# Altium schematic sheet driver.SchDoc: driver
size 582 x 469 mm; Origin: Eagle; Date: 4/18/2023 7:39:10 AM; SheetNumber: 1; GateName_1: G$1; SymbolName_1: FRAME_C_L; LibraryName: frames; DeviceSetName: FRAME_C_L; GateName_2: G$2; SymbolName_2: DOCFIELD; Sheet: Sheet:; REV: REV:
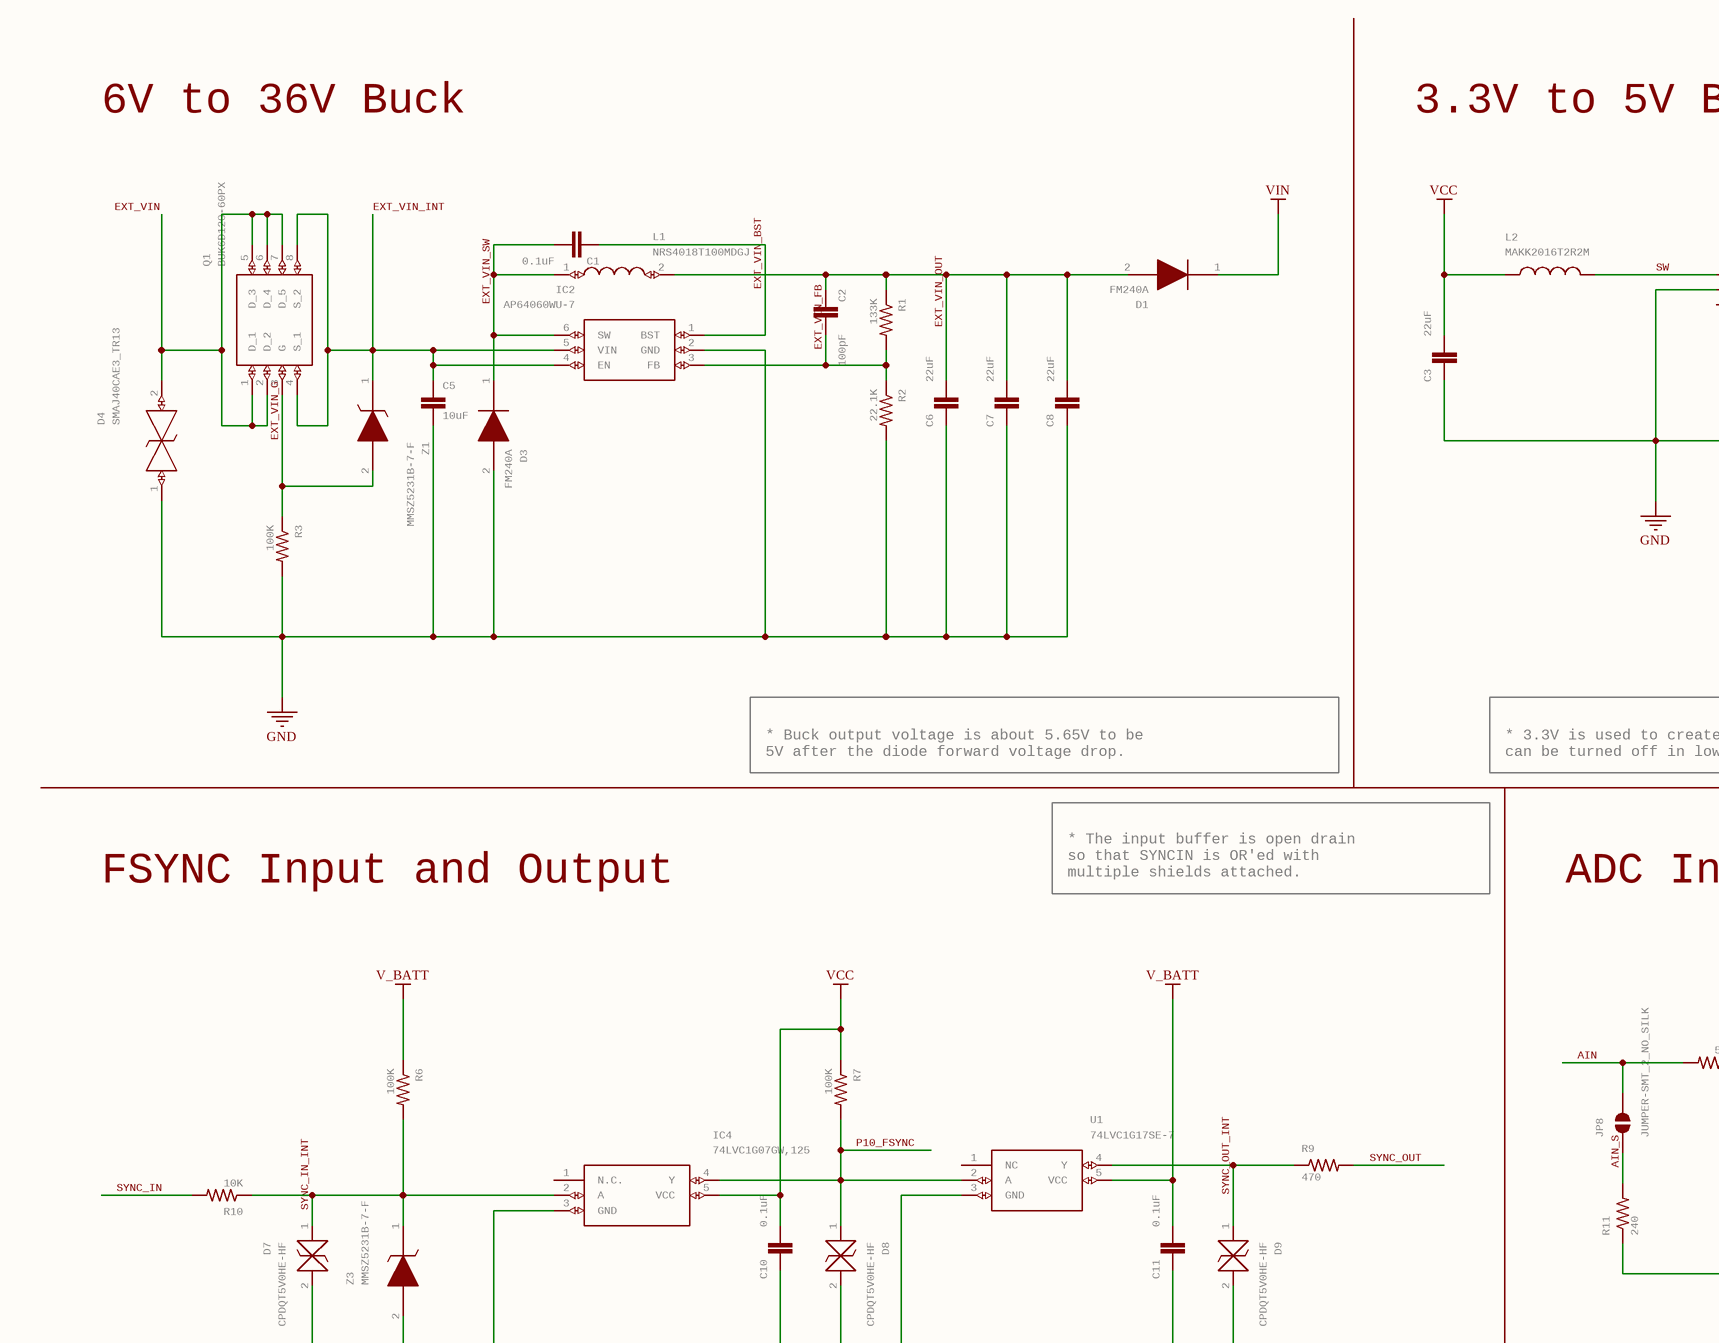
[diagram p0: driver.SchDoc, top left]
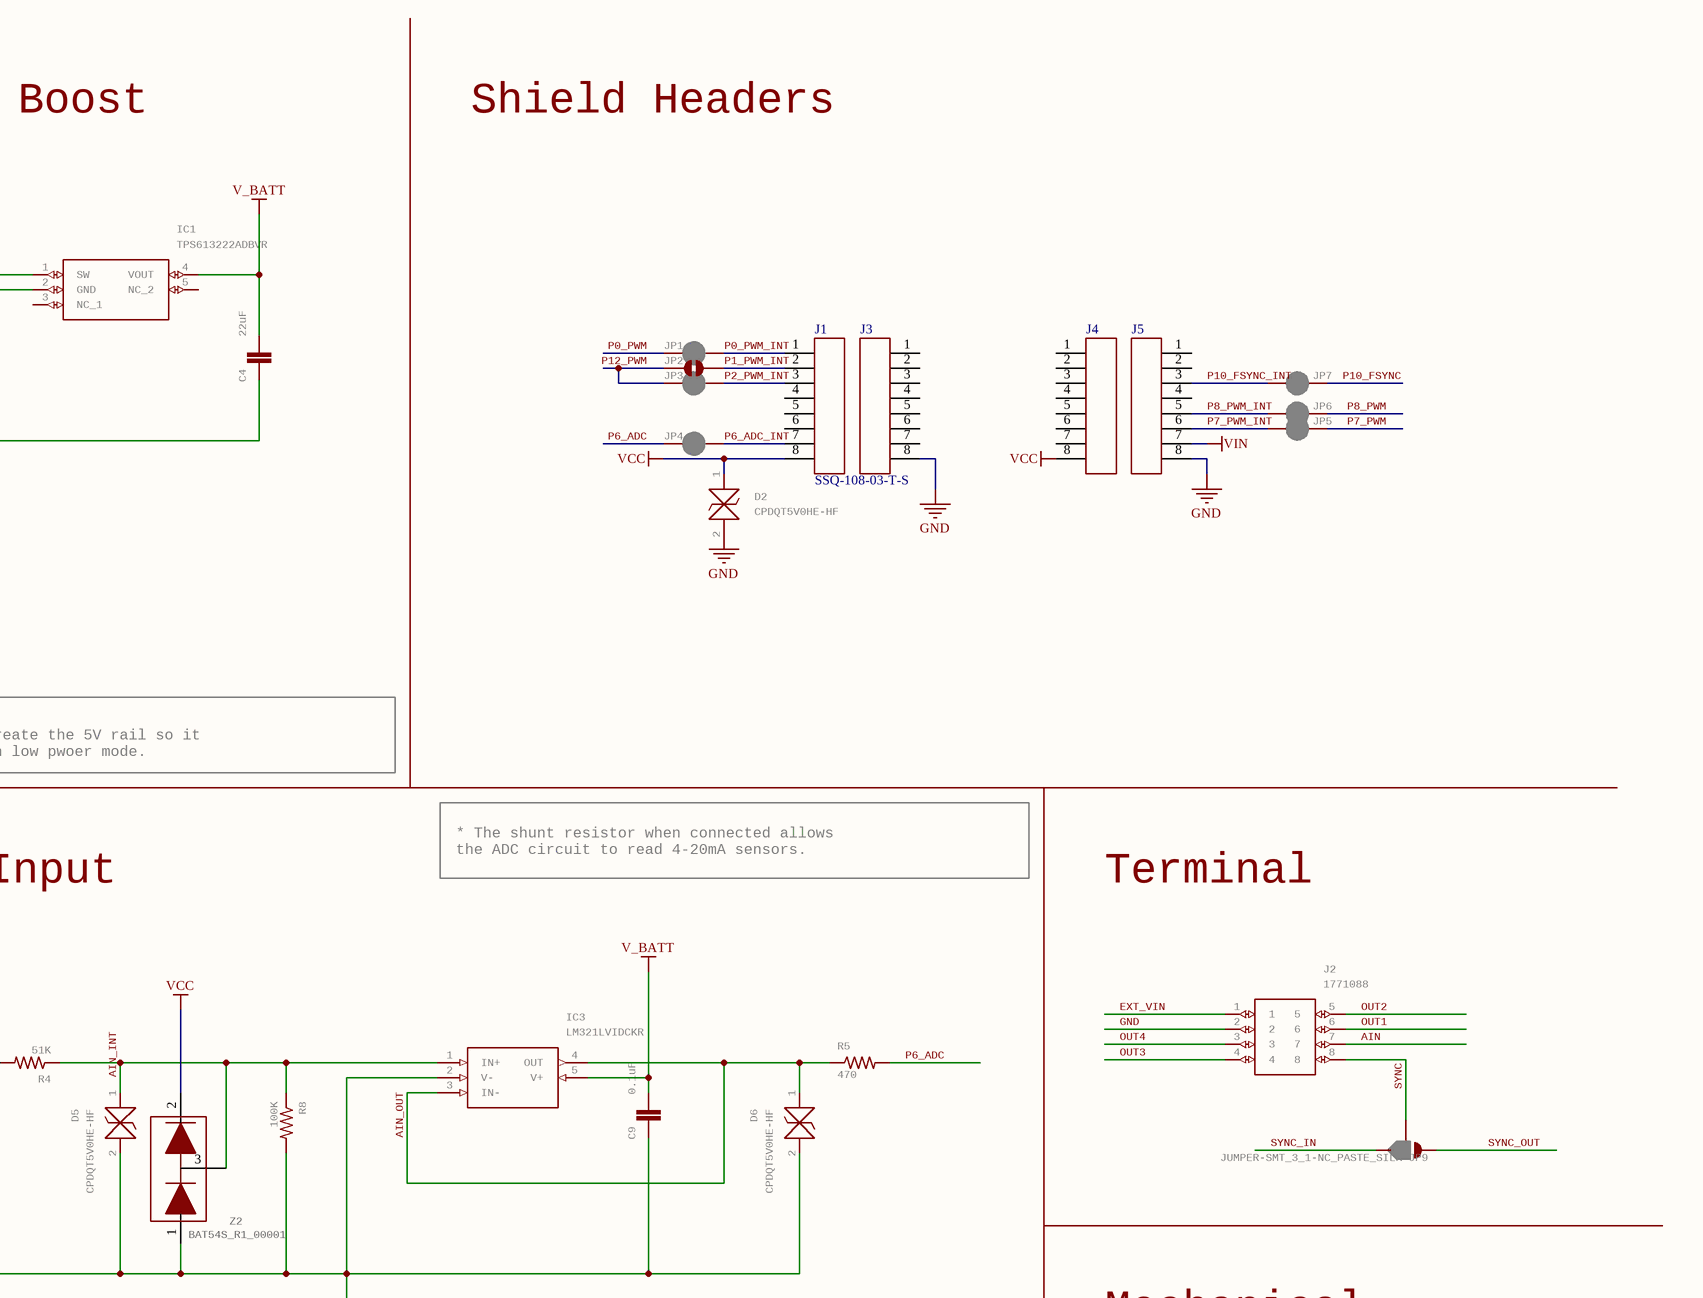
[diagram p1: driver.SchDoc, top right]
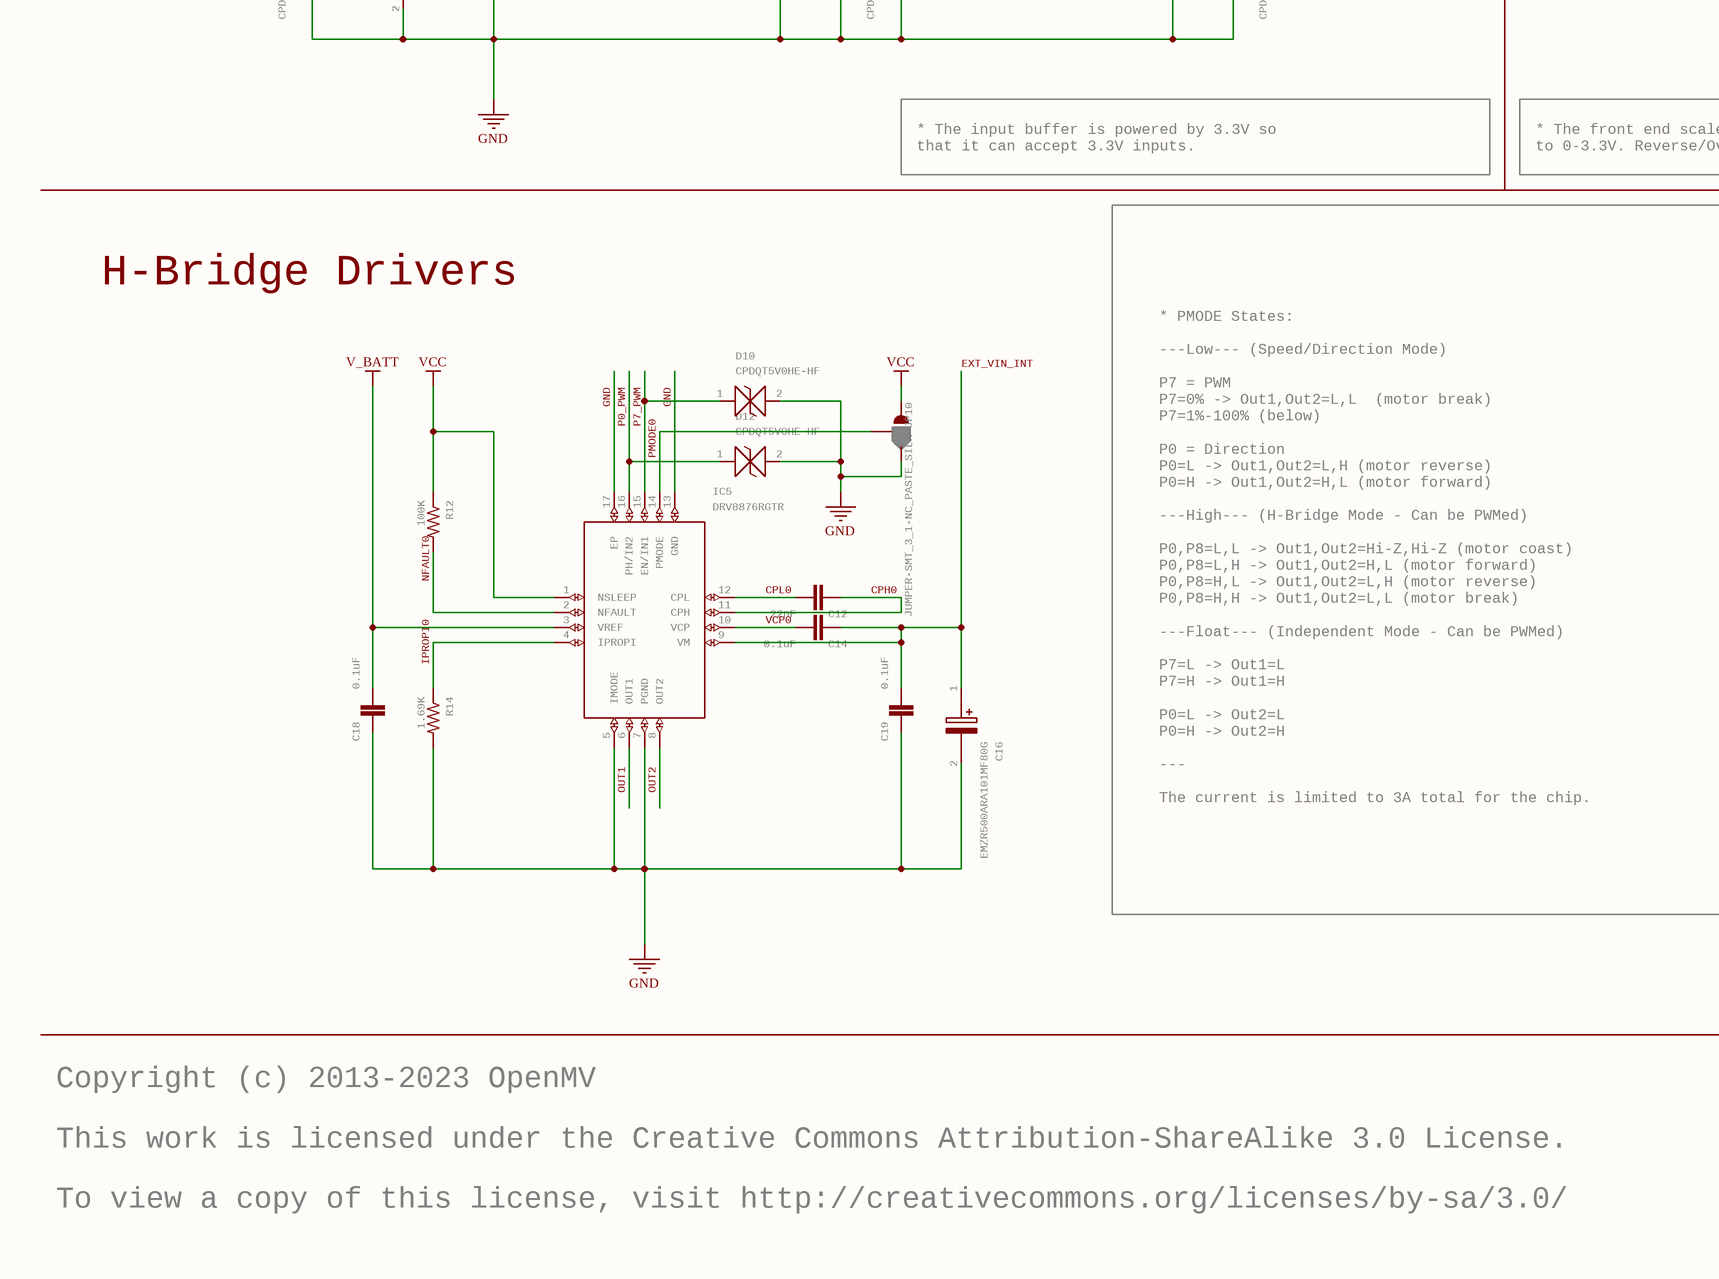
[diagram p2: driver.SchDoc, bottom left]
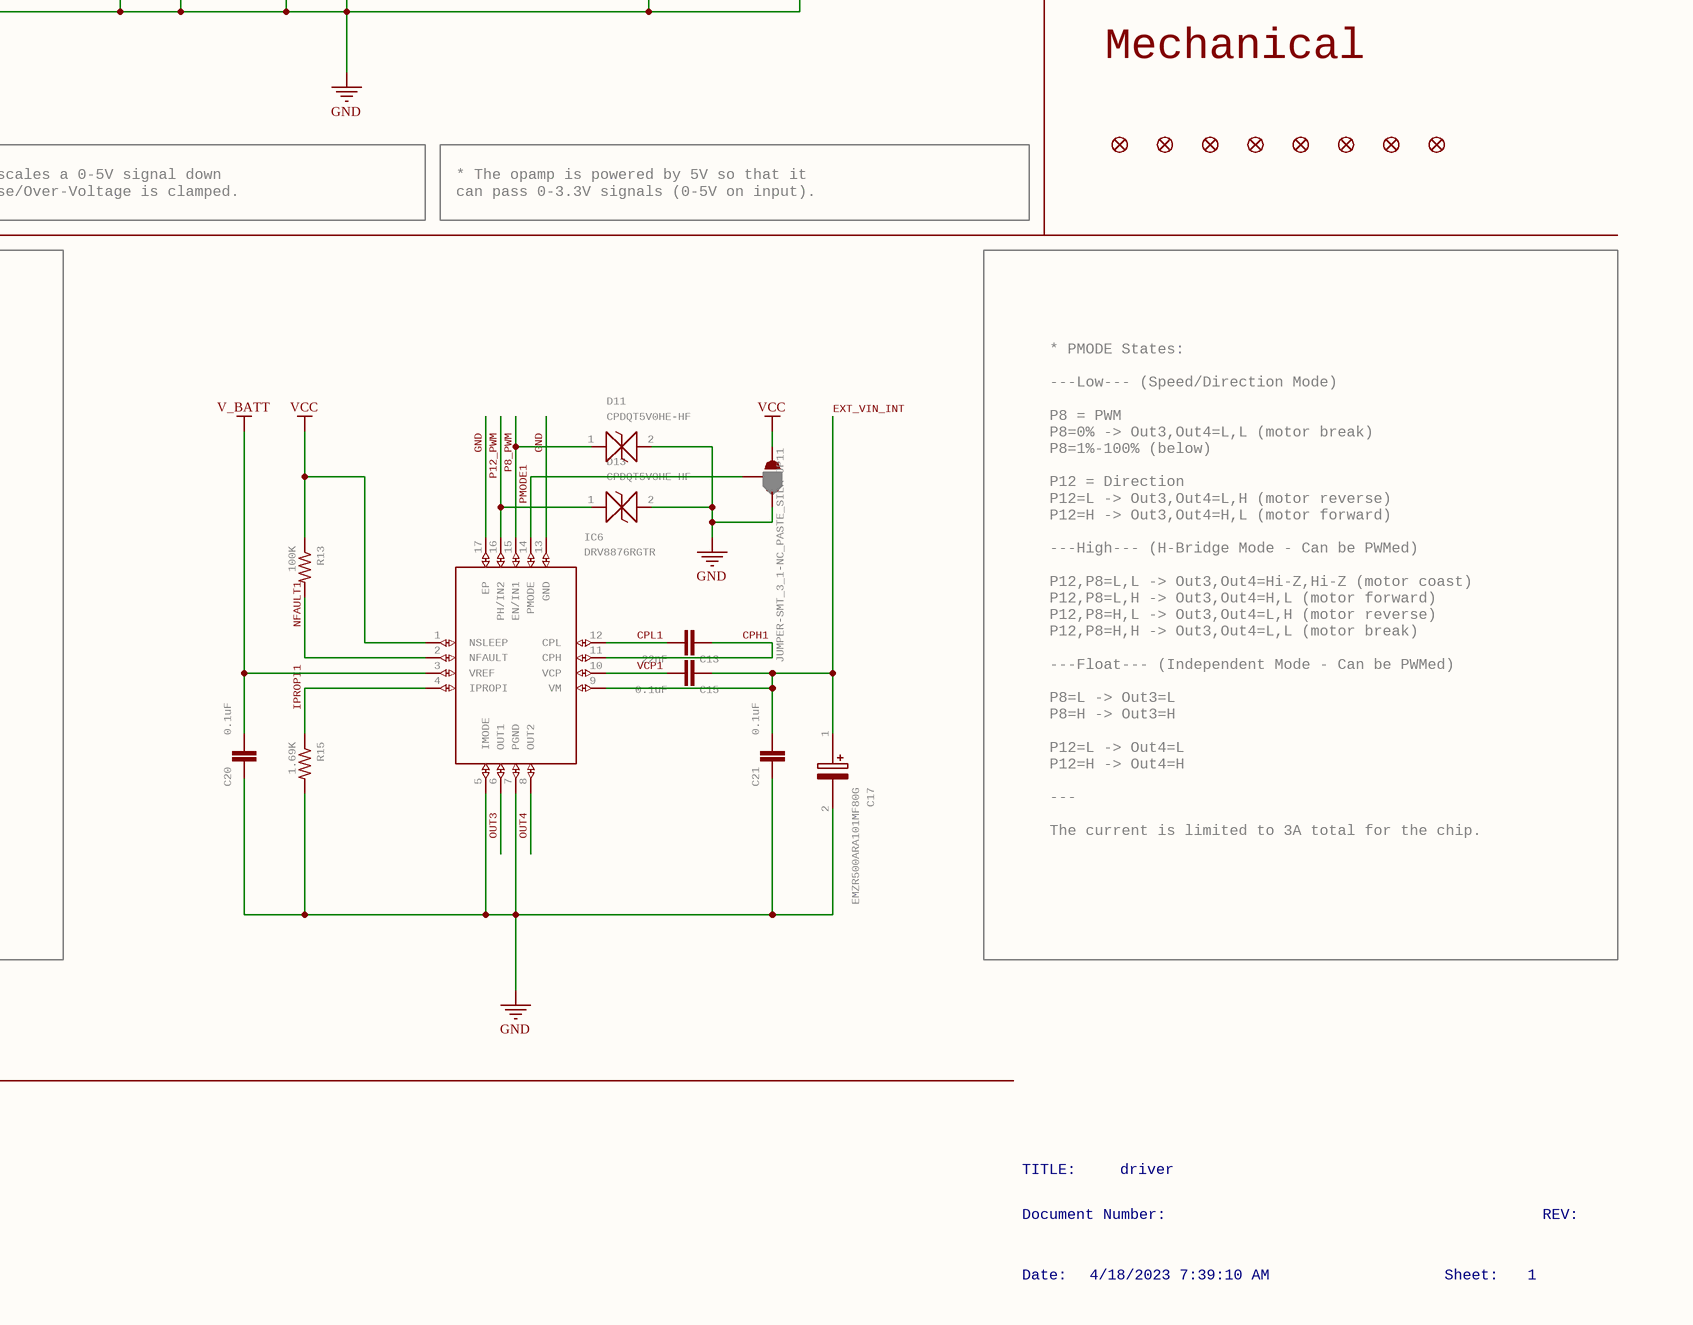
[diagram p3: driver.SchDoc, bottom right]

## Parts
C1  0.1uF  [0402-CAP]
C2  100pF  [0402-CAP]
C3  22uF  [0805]
C4  22uF  [0805]
C5  10uF  [C0805]
C6  22uF  [0805]
C7  22uF  [0805]
C8  22uF  [0805]
C9  0.1uF  [0402-CAP]
C10  0.1uF  [0402-CAP]
C11  0.1uF  [0402-CAP]
C12  22nF  [0402-CAP]
C13  22nF  [0402-CAP]
C14  0.1uF  [0402-CAP]
C15  0.1uF  [0402-CAP]
C16  EMZR500ARA101MF80G  [CAPAE660X820N]
C17  EMZR500ARA101MF80G  [CAPAE660X820N]
C18  0.1uF  [0402-CAP]
C19  0.1uF  [0402-CAP]
C20  0.1uF  [0402-CAP]
C21  0.1uF  [0402-CAP]
D1  FM240A  [DIOM5025X231N]
D2  CPDQT5V0HE-HF  [CPDQT5V0HEHF]
D3  FM240A  [DIOM5025X231N]
D4  SMAJ40CAE3_TR13  [SMAJ40CAE3TR13]
D5  CPDQT5V0HE-HF  [CPDQT5V0HEHF]
D6  CPDQT5V0HE-HF  [CPDQT5V0HEHF]
D7  CPDQT5V0HE-HF  [CPDQT5V0HEHF]
D8  CPDQT5V0HE-HF  [CPDQT5V0HEHF]
D9  CPDQT5V0HE-HF  [CPDQT5V0HEHF]
D10  CPDQT5V0HE-HF  [CPDQT5V0HEHF]
D11  CPDQT5V0HE-HF  [CPDQT5V0HEHF]
D12  CPDQT5V0HE-HF  [CPDQT5V0HEHF]
D13  CPDQT5V0HE-HF  [CPDQT5V0HEHF]
FD1  FIDUCIAL1X2  [FIDUCIAL-1X2]  (value not drawn)
FD2  FIDUCIAL1X2  [FIDUCIAL-1X2]  (value not drawn)
FD3  FIDUCIAL1X2  [FIDUCIAL-1X2]  (value not drawn)
FD4  FIDUCIAL1X2  [FIDUCIAL-1X2]  (value not drawn)
FD5  FIDUCIAL1X2  [FIDUCIAL-1X2]  (value not drawn)
FD6  FIDUCIAL1X2  [FIDUCIAL-1X2]  (value not drawn)
FD7  FIDUCIAL1X2  [FIDUCIAL-1X2]  (value not drawn)
FD8  FIDUCIAL1X2  [FIDUCIAL-1X2]  (value not drawn)
IC1  TPS613222ADBVR  [SOT95P280X145-5N]
IC2  AP64060WU-7  [SOT95P280X100-6N]
IC3  LM321LVIDCKR  [SOT65P210X110-5N]
IC4  74LVC1G07GW,125  [SOT65P212X110-5N]
IC5  DRV8876RGTR  [QFN50P300X300X100-17N]
IC6  DRV8876RGTR  [QFN50P300X300X100-17N]
J1  SSQ-108-03-T-S  [HDR_1X8]
J2  1771088  [1771088]
J3  SSQ-108-03-T-S  [HDR_1X8]  (value not drawn)
J4  SSQ-108-03-T-S  [HDR_1X8]  (value not drawn)
J5  SSQ-108-03-T-S  [HDR_1X8]  (value not drawn)
JP1  JUMPER-SMT_2_NC_PASTE_SILK  [SMT-JUMPER_2_NC_PASTE_SILK]  (value not drawn)
JP2  JUMPER-SMT_2_NO_SILK  [SMT-JUMPER_2_NO_SILK]  (value not drawn)
JP3  JUMPER-SMT_2_NC_PASTE_SILK  [SMT-JUMPER_2_NC_PASTE_SILK]  (value not drawn)
JP4  JUMPER-SMT_2_NC_PASTE_SILK  [SMT-JUMPER_2_NC_PASTE_SILK]  (value not drawn)
JP5  JUMPER-SMT_2_NC_PASTE_SILK  [SMT-JUMPER_2_NC_PASTE_SILK]  (value not drawn)
JP6  JUMPER-SMT_2_NC_PASTE_SILK  [SMT-JUMPER_2_NC_PASTE_SILK]  (value not drawn)
JP7  JUMPER-SMT_2_NC_PASTE_SILK  [SMT-JUMPER_2_NC_PASTE_SILK]  (value not drawn)
JP8  JUMPER-SMT_2_NO_SILK  [SMT-JUMPER_2_NO_SILK]
JP9  JUMPER-SMT_3_1-NC_PASTE_SILK  [SMT-JUMPER_3_1-NC_PASTE_SILK]
JP10  JUMPER-SMT_3_1-NC_PASTE_SILK  [SMT-JUMPER_3_1-NC_PASTE_SILK]
JP11  JUMPER-SMT_3_1-NC_PASTE_SILK  [SMT-JUMPER_3_1-NC_PASTE_SILK]
L1  NRS4018T100MDGJ  [NRS4018T100MDGJ]
L2  MAKK2016T2R2M  [INDC2016X100N]
Q1  BUK6D120-60PX  [BUK6D12060PX]
R1  133K  [0402-RES]
R2  22.1K  [0402-RES]
R3  100K  [0402-RES]
R4  51K  [0402-RES]
R5  470  [R0603]
R6  100K  [0402-RES]
R7  100K  [0402-RES]
R8  100K  [0402-RES]
R9  470  [R0603]
R10  10K  [0402-RES]
R11  240  [R0603]
R12  100K  [0402-RES]
R13  100K  [0402-RES]
R14  1.69K  [0402-RES]
R15  1.69K  [0402-RES]
U1  74LVC1G17SE-7  [SOT65P210X110-5N]
Z1  MMSZ5231B-7-F  [SOD3716X145N]
Z2  BAT54S_R1_00001  [SOT23-3]
Z3  MMSZ5231B-7-F  [SOD3716X145N]

## Nets
GND: C3.1 C4.1 C5.2 C6.1 C7.1 C8.1 C9.1 C10.1 C11.1 C16.2(-) C17.2(-) C18.1 C19.1 C20.1 C21.1 D2.2 D3.2(A) D4.1 D5.2 D6.2 D7.2 D8.2 D9.2 D10.2 D11.2 D12.2 D13.2 IC1.2(GND) IC2.2(GND) IC3.2(V-) IC4.3(GND) IC5.5(IMODE) IC5.7(PGND) IC5.13(GND) IC5.17(EP) IC6.5(IMODE) IC6.7(PGND) IC6.13(GND) IC6.17(EP) J2.2 J3.8 J5.8 JP10.3 JP11.3 R2.2 R3.2 R8.2 R11.1 R14.2 R15.2 U1.3(GND) Z2.1 Z3.2(A)
V_BATT: C4.2 C9.2 C11.2 C18.2 C20.2 IC1.4(VOUT) IC3.5(V+) IC5.3(VREF) IC6.3(VREF) R6.1 U1.5(VCC)
VCC: C3.2 C10.2 D2.1 IC4.5(VCC) IC5.1(NSLEEP) IC6.1(NSLEEP) J1.8 J4.8 JP10.1 JP11.1 L2.1 R7.1 R12.1 R13.1 Z2.2
VIN: D1.1(K) J5.7
AIN: J2.7 JP8.2 R4.2
AIN_INT: D5.1 IC3.1(IN+) R4.1 R8.1 Z2.3
AIN_OUT: D6.1 IC3.3(IN-) IC3.4(OUT) R5.1
AIN_S: JP8.1 R11.2
CPH0: C12.1 IC5.11(CPH)
CPH1: C13.1 IC6.11(CPH)
CPL0: C12.2 IC5.12(CPL)
CPL1: C13.2 IC6.12(CPL)
EXT_VIN: D4.2 J2.1 Q1.1(D_1) Q1.2(D_2) Q1.5(D_3) Q1.6(D_4) Q1.7(D_5)
EXT_VIN_BST: C1.1 IC2.1(BST)
EXT_VIN_FB: C2.2 IC2.3(FB) R1.2 R2.1
EXT_VIN_G: Q1.3(G) R3.1 Z1.2(A)
EXT_VIN_INT: C5.1 C14.1 C15.1 C16.1(+) C17.1(+) C19.2 C21.2 IC2.4(EN) IC2.5(VIN) IC5.9(VM) IC6.9(VM) Q1.4(S_1) Q1.8(S_2) Z1.1(K)
EXT_VIN_OUT: C2.1 C6.2 C7.2 C8.2 D1.2(A) L1.2 R1.1
EXT_VIN_SW: C1.2 D3.1(K) IC2.6(SW) L1.1
IPROPI0: IC5.4(IPROPI) R14.1
IPROPI1: IC6.4(IPROPI) R15.1
NFAULT0: IC5.2(NFAULT) R12.2
NFAULT1: IC6.2(NFAULT) R13.2
OUT1: IC5.6(OUT1) J2.6
OUT2: IC5.8(OUT2) J2.5
OUT3: IC6.6(OUT1) J2.4
OUT4: IC6.8(OUT2) J2.3
P0_PWM: D12.1 IC5.16(PH/IN2) JP1.2
P0_PWM_INT: J1.1 JP1.1
P1_PWM_INT: J1.2 JP2.1
P2_PWM_INT: J1.3 JP3.1
P6_ADC: JP4.2 R5.2
P6_ADC_INT: J1.7 JP4.1
P7_PWM: D10.1 IC5.15(EN/IN1) JP5.2
P7_PWM_INT: J5.6 JP5.1
P8_PWM: D11.1 IC6.15(EN/IN1) JP6.2
P8_PWM_INT: J5.5 JP6.1
P10_FSYNC: D8.1 IC4.4(Y) JP7.2 R7.2 U1.2(A)
P10_FSYNC_INT: J5.3 JP7.1
P12_PWM: D13.1 IC6.16(PH/IN2) JP2.2 JP3.2
PMODE0: IC5.14(PMODE) JP10.2
PMODE1: IC6.14(PMODE) JP11.2
SW: IC1.1(SW) L2.2
SYNC: J2.8 JP9.2
SYNC_IN: JP9.3 R10.2
SYNC_IN_INT: D7.1 IC4.2(A) R6.2 R10.1 Z3.1(K)
SYNC_OUT: JP9.1 R9.2
SYNC_OUT_INT: D9.1 R9.1 U1.4(Y)
VCP0: C14.2 IC5.10(VCP)
VCP1: C15.2 IC6.10(VCP)

Not connected (* = marked no-connect by the designer): IC1 3(NC_1) 5(NC_2); IC4 1(N.C.); J1 4 5 6; J3 1 2 3 4 5 6 7; J4 1 2 3 4 5 6 7; J5 1 2 4; U1 1(NC)

## Notes on the sheet
- 6V to 36V Buck
- 3.3V to 5V Boost
- Shield Headers
- * Buck output voltage is about 5.65V to be
  5V after the diode forward voltage drop.
- * 3.3V is used to create the 5V rail so it
  can be turned off in low pwoer mode.
- * The shunt resistor when connected allows
  the ADC circuit to read 4-20mA sensors.
- FSYNC Input and Output
- * The input buffer is open drain
  so that SYNCIN is OR'ed with
  multiple shields attached.
- ADC Input
- Terminal
- Mechanical
- * The input buffer is powered by 3.3V so
  that it can accept 3.3V inputs.
- * The front end scales a 0-5V signal down
  to 0-3.3V. Reverse/Over-Voltage is clamped.
- * The opamp is powered by 5V so that it
  can pass 0-3.3V signals (0-5V on input).
- H-Bridge Drivers
- * PMODE States:
  ---Low--- (Speed/Direction Mode)
  P7 = PWM
  P7=0% -> Out1,Out2=L,L  (motor break)
  P7=1%-100% (below)
  P0 = Direction
  P0=L -> Out1,Out2=L,H (motor reverse)
  P0=H -> Out1,Out2=H,L (motor forward)
  ---High--- (H-Bridge Mode - Can be PWMed)
  P0,P8=L,L -> Out1,Out2=Hi-Z,Hi-Z (motor coast)
  P0,P8=L,H -> Out1,Out2=H,L (motor forward)
  P0,P8=H,L -> Out1,Out2=L,H (motor reverse)
  P0,P8=H,H -> Out1,Out2=L,L (motor break)
  ---Float--- (Independent Mode - Can be PWMed)
  P7=L -> Out1=L
  P7=H -> Out1=H
  P0=L -> Out2=L
  P0=H -> Out2=H
  ---
  The current is limited to 3A total for the chip.
- * PMODE States:
  ---Low--- (Speed/Direction Mode)
  P8 = PWM
  P8=0% -> Out3,Out4=L,L (motor break)
  P8=1%-100% (below)
  P12 = Direction
  P12=L -> Out3,Out4=L,H (motor reverse)
  P12=H -> Out3,Out4=H,L (motor forward)
  ---High--- (H-Bridge Mode - Can be PWMed)
  P12,P8=L,L -> Out3,Out4=Hi-Z,Hi-Z (motor coast)
  P12,P8=L,H -> Out3,Out4=H,L (motor forward)
  P12,P8=H,L -> Out3,Out4=L,H (motor reverse)
  P12,P8=H,H -> Out3,Out4=L,L (motor break)
  ---Float--- (Independent Mode - Can be PWMed)
  P8=L -> Out3=L
  P8=H -> Out3=H
  P12=L -> Out4=L
  P12=H -> Out4=H
  ---
  The current is limited to 3A total for the chip.
- Copyright (c) 2013-2023 OpenMV
- TITLE:
- driver
- This work is licensed under the Creative Commons Attribution-ShareAlike 3.0 License.
- To view a copy of this license, visit http://creativecommons.org/licenses/by-sa/3.0/
- Document Number:
- REV:
- Date:
- 4/18/2023 7:39:10 AM
- Sheet:
- 1

## Library data of the parts
C1 C9-C11 C14 C15 C18-C21 = CAP0402-CAP: CapacitorStandard 0603 ceramic capacitor, and 0.1" leaded capacitor.; MPN: GRM155R71H104KE14D; GateName_1: G$1; SymbolName_1: CAP; DeviceName: 0402-CAP; LibraryName: sfe; DeviceSetName: CAP
C2 = CAP0402-CAP: CapacitorStandard 0603 ceramic capacitor, and 0.1" leaded capacitor.; MPN: CC0402JRNPO9BN101; GateName_1: G$1; SymbolName_1: CAP; DeviceName: 0402-CAP; LibraryName: sfe; DeviceSetName: CAP
C3 C4 C6-C8 = 22UF-0805-6.3V-20%: 22ÂµF ceramic capacitors    A capacitor is a passive two-terminal electrical component used to store electrical energy temporarily in an electric field.; MPN: CL21A226MQQNNNE; GateName_1: G$1; SymbolName_1: CAP; PROD_ID: CAP-08402; DeviceName: -0805-6.3V-20%; LibraryName: SparkFun-Capacitors; DeviceSetName: 22UF
C5 = C-EUC0805: CAPACITOR, European symbol; MPN: GRM21BR61H106KE43K; GateName_1: G$1; SymbolName_1: C-EU; POPULARITY: 88; DeviceName: C0805; LibraryName: rcl; DeviceSetName: C-EU; SPICEPREFIX: C
C12 C13 = CAP0402-CAP: CapacitorStandard 0603 ceramic capacitor, and 0.1" leaded capacitor.; MPN: GRM155R71H223KA12D; GateName_1: G$1; SymbolName_1: CAP; DeviceName: 0402-CAP; LibraryName: sfe; DeviceSetName: CAP
C16 C17 = EMZR500ARA101MF80G: Aluminum Electrolytic Capacitors - SMD 100uF 50V 20%   Source:  Datasheet; MANUFACTURER_NAME: Chemi-Con; GateName_1: G$1; SymbolName_1: EMZR500ARA101MF80G; LibraryName: EMZR500ARA101MF80G; DeviceSetName: EMZR500ARA101MF80G; HEIGHT: 8.2mm; MANUFACTURER_PART_NUMBER: EMZR500ARA101MF80G; MOUSER_PART_NUMBER: 661-EMZR500ARA101MF8; MOUSER_PRICE-STOCK: https://www.mouser.co.uk/ProductDetail/United-Chemi-Con/EMZR500ARA101MF80G?qs=y6ZabgHbY%252ByQ3zUEIlMmqw%3D%3D; MPN: EMZR500ARA101MF80G
D1 D3 = FM240A: Diodes - General Purpose, Power, Switching GP Si Rectifier SMB,2A,40V   Source:  Datasheet; MANUFACTURER_NAME: Rectron; GateName_1: G$1; SymbolName_1: FM240A; LibraryName: FM240A; DeviceSetName: FM240A; HEIGHT: 2.31mm; MANUFACTURER_PART_NUMBER: FM240A; MOUSER_PART_NUMBER: 583-FM240A; MOUSER_PRICE-STOCK: https://www.mouser.co.uk/ProductDetail/Rectron/FM240A?qs=7pEAo90IqNG7sknZwmLYhQ%3D%3D; MPN: FM240A
D2 D5-D13 = CPDQT5V0HE-HF: ESD Suppressors / TVS Diodes DIODE ESD 5VWM 65W 0402/SOD-923F   Source:  Datasheet; MANUFACTURER_NAME: Comchip Technology; GateName_1: G$1; SymbolName_1: CPDQT5V0HE-HF; LibraryName: CPDQT5V0HE-HF; DeviceSetName: CPDQT5V0HE-HF; HEIGHT: 0.42mm; MANUFACTURER_PART_NUMBER: CPDQT5V0HE-HF; MOUSER_PART_NUMBER: MOUSER_PART_NUMBER; MOUSER_PRICE-STOCK: MOUSER_PRICE-STOCK; MPN: CPDQT5V0HE-HF
D4 = SMAJ40CAE3_TR13: ESD Suppressors / TVS Diodes TVS   Source:  Datasheet; MANUFACTURER_NAME: Microchip; MANUFACTURER_PART_NUMBER: SMAJ40CAe3/TR13; GateName_1: G$1; SymbolName_1: SMAJ40CAE3_TR13; LibraryName: SMAJ40CAe3_TR13; DeviceSetName: SMAJ40CAE3_TR13; HEIGHT: 3.05mm; MOUSER_PART_NUMBER: 494-SMAJ40CAE3/TR13; MOUSER_PRICE-STOCK: https://www.mouser.co.uk/ProductDetail/Microchip-Technology/SMAJ40CAe3-TR13?qs=pU29NIZ4ZwCw3PnlxOleOw%3D%3D; MPN: SMAJ40CAe3/TR13
FD1-FD8 = FIDUCIAL1X2: Fiducial Alignment Points    Point-of-reference for pick-and-place machines and other optical instruments.; GateName_1: G$1; DeviceName: 1X2; SymbolName_1: FIDUCIAL; LibraryName: SparkFun-Aesthetics; DeviceSetName: FIDUCIAL
IC1 = TPS613222ADBVR: 6-uA Quiescent Current, 1.8-A Switch Current Boost Converter   Source:  Datasheet; MANUFACTURER_NAME: Texas Instruments; GateName_1: G$1; SymbolName_1: TPS613222ADBVR; LibraryName: TPS613222ADBVR; DeviceSetName: TPS613222ADBVR; HEIGHT: 1.45mm; MANUFACTURER_PART_NUMBER: TPS613222ADBVR; MOUSER_PART_NUMBER: 595-TPS613222ADBVR; MOUSER_PRICE-STOCK: https://www.mouser.co.uk/ProductDetail/Texas-Instruments/TPS613222ADBVR?qs=W0yvOO0ixfE4d69WXsn8NQ%3D%3D; MPN: TPS613222ADBVR
IC2 = AP64060WU-7: Switching Voltage Regulators DCDC Conv HV Buck TSOT26(STD) T&R 3K   Source:  Datasheet; MANUFACTURER_NAME: Diodes Inc.; GateName_1: G$1; SymbolName_1: AP64060WU-7; LibraryName: AP64060WU-7; DeviceSetName: AP64060WU-7; HEIGHT: 1mm; MANUFACTURER_PART_NUMBER: AP64060WU-7; MOUSER_PART_NUMBER: 621-AP64060WU-7; MOUSER_PRICE-STOCK: https://www.mouser.co.uk/ProductDetail/Diodes-Incorporated/AP64060WU-7?qs=Li%252BoUPsLEntiZYjFw%252BCbiQ%3D%3D; MPN: AP64060WU-7
IC3 = LM321LVIDCKR: 1-Channel industry standard low voltage operational amplifier   Source:  Datasheet; MANUFACTURER_NAME: Texas Instruments; GateName_1: G$1; SymbolName_1: LM321LVIDCKR; LibraryName: LM321LVIDCKR; DeviceSetName: LM321LVIDCKR; HEIGHT: 1.1mm; MANUFACTURER_PART_NUMBER: LM321LVIDCKR; MOUSER_PART_NUMBER: 595-LM321LVIDCKR; MOUSER_PRICE-STOCK: https://www.mouser.co.uk/ProductDetail/Texas-Instruments/LM321LVIDCKR?qs=qSfuJ%252Bfl%2Fd6RcyTOjkRx5Q%3D%3D; MPN: LM321LVIDCKR
IC4 = 74LVC1G07GW,125: 74LVC1G07 - Buffer with open-drain output@en-us   Source:  Datasheet; MANUFACTURER_NAME: Nexperia; GateName_1: G$1; SymbolName_1: 74LVC1G07GW,125; LibraryName: 74LVC1G07GW_125; DeviceSetName: 74LVC1G07GW,125; HEIGHT: 1.1mm; MANUFACTURER_PART_NUMBER: 74LVC1G07GW,125; MOUSER_PART_NUMBER: 771-74LVC1G07GW-G; MOUSER_PRICE-STOCK: https://www.mouser.co.uk/ProductDetail/Nexperia/74LVC1G07GW125?qs=me8TqzrmIYW763Mg%2FG86Uw%3D%3D; MPN: 74LVC1G07GW,125
IC5 IC6 = DRV8876RGTR: Motor / Motion / Ignition Controllers & Drivers 37-V, 3.5-A brushed DC motor driver with integrated current sensing and current sense output 16-VQFN -40 to 125   Source:  Datasheet; MANUFACTURER_NAME: Texas Instruments; GateName_1: G$1; SymbolName_1: DRV8876RGTR; LibraryName: DRV8876RGTR; DeviceSetName: DRV8876RGTR; HEIGHT: 1mm; MANUFACTURER_PART_NUMBER: DRV8876RGTR; MOUSER_PART_NUMBER: 595-DRV8876RGTR; MOUSER_PRICE-STOCK: https://www.mouser.co.uk/ProductDetail/Texas-Instruments/DRV8876RGTR?qs=T3oQrply3y%2F6lJwB3MIeHA%3D%3D; MPN: DRV8876RGTR
J1 J3-J5 = HDR_1X8: MANUFACTURER P/N: SSQ-108-03-T-S
J2 = 1771088: PCB terminal block, nominal current: 6 A, rated voltage (III/2): 160 V, nominal cross section: 0.5 mm?, Number of potentials: 8, Number of rows: 1, Number of positions per row: 8, product range: PTSM 0,5/..-H-SMD, pitch: 2.5 mm, connection method: Push-in spring connection, mounting: SMD soldering, conductor/PCB connection direction: 0 ?, color: black, Pin layout: Linear pad geometry, type of packaging: packed in cardboard   Source:  Datasheet; MANUFACTURER_NAME: Phoenix Contact; GateName_1: G$1; SymbolName_1: 1771088; LibraryName: 1771088; DeviceSetName: 1771088; HEIGHT: 5.22mm; MANUFACTURER_PART_NUMBER: 1771088; MOUSER_PART_NUMBER: 651-1771088; MOUSER_PRICE-STOCK: https://www.mouser.co.uk/ProductDetail/Phoenix-Contact/1771088?qs=Q77YN%2FRrsKIDMojcNKtpFQ%3D%3D; MPN: 1771088
JP1 JP3-JP7 = JUMPER-SMT_2_NC_PASTE_SILK: Normally closed solder jumper    This jumper has an aperture in the stencil to allow solder paste to bridge the split in the wire so it's normally closed (NC). Wick off the solder to open the connection. Reapply solder to reclose the connection.; GateName_1: G$1; SymbolName_1: SMT-JUMPER_2_NC_PASTE; DeviceName: _SILK; LibraryName: SparkFun-Jumpers; DeviceSetName: JUMPER-SMT_2_NC_PASTE
JP2 JP8 = JUMPER-SMT_2_NO_SILK: Normally open jumper    This jumper has two pads in close proximity to each other. Apply solder to close the connection.   Round pads are easier to solder for beginners, but are a lot larger.   SparkFun Product that uses the round pads:  SparkFun EL Sequencer; GateName_1: G$1; SymbolName_1: SMT-JUMPER_2_NO; DeviceName: _SILK; LibraryName: SparkFun-Jumpers; DeviceSetName: JUMPER-SMT_2_NO
JP9-JP11 = JUMPER-SMT_3_1-NC_PASTE_SILK: Normally closed solder jumper (1 of 2 connections)    This jumper has an aperture in the stencil to allow solder paste to bridge one of the two connections. One connection is normally closed (NC), while the other is normally open (NO). Wick off the solder to open the connection. Reapply solder to reclose the connection. Apply solder to the other side instead to change the current path.; GateName_1: G$1; SymbolName_1: SMT-JUMPER_3_1-NC_PASTE; DeviceName: _SILK; LibraryName: SparkFun-Jumpers; DeviceSetName: JUMPER-SMT_3_1-NC_PASTE
L1 = NRS4018T100MDGJ: Fixed Inductors 4018 10uH 180mOhms +/-20%Tol 1200mA   Source:  Datasheet; MANUFACTURER_NAME: TAIYO YUDEN; GateName_1: G$1; SymbolName_1: NRS4018T100MDGJ; LibraryName: NRS4018T100MDGJ; DeviceSetName: NRS4018T100MDGJ; HEIGHT: 1mm; MANUFACTURER_PART_NUMBER: NRS4018T100MDGJ; MOUSER_PART_NUMBER: 963-NRS4018T100MDGJ; MOUSER_PRICE-STOCK: https://www.mouser.co.uk/ProductDetail/TAIYO-YUDEN/NRS4018T100MDGJ?qs=PzICbMaShUeiyHfvjt6KEw%3D%3D; MPN: NRS4018T100MDGJ
L2 = MAKK2016T2R2M: INDUCTOR, METAL CORE Check availability; GateName_1: G$1; MF: Taiyo Yuden; SymbolName_1: MAKK2016T2R2M; LibraryName: MAKK2016T2R2M; DeviceSetName: MAKK2016T2R2M; AVAILABILITY: In Stock; MP: MAKK2016T2R2M; MPN: MAKK2016T2R2M; PACKAGE: 2016 Taiyo Yuden; PRICE: None; PURCHASE-URL: https://pricing.snapeda.com/search/part/MAKK2016T2R2M/?ref=eda
Q1 = BUK6D120-60PX: MOSFET 60V P-CH TRENCHMOS SOT1220   Source:  Datasheet; MANUFACTURER_NAME: Nexperia; GateName_1: G$1; SymbolName_1: BUK6D120-60PX; LibraryName: BUK6D120-60PX; DeviceSetName: BUK6D120-60PX; HEIGHT: 0.65mm; MANUFACTURER_PART_NUMBER: BUK6D120-60PX; MOUSER_PART_NUMBER: 771-BUK6D120-60PX; MOUSER_PRICE-STOCK: https://www.mouser.co.uk/ProductDetail/Nexperia/BUK6D120-60PX?qs=F5EMLAvA7IBtoNC2L3hOcQ%3D%3D; MPN: BUK6D120-60PX
R1 = RESISTOR0402-RES: ResistorBasic schematic elements and footprints for 0603, 1206, and PTH resistors.; MPN: RC0402FR-07133KL; GateName_1: G$1; SymbolName_1: RESISTOR; DeviceName: 0402-RES; LibraryName: sfe; DeviceSetName: RESISTOR
R2 = RESISTOR0402-RES: ResistorBasic schematic elements and footprints for 0603, 1206, and PTH resistors.; MPN: CR0402-FX-2212GLF; GateName_1: G$1; SymbolName_1: RESISTOR; DeviceName: 0402-RES; LibraryName: sfe; DeviceSetName: RESISTOR
R3 R6-R8 R12 R13 = RESISTOR0402-RES: ResistorBasic schematic elements and footprints for 0603, 1206, and PTH resistors.; MPN: AC0402FR-07100KL; GateName_1: G$1; SymbolName_1: RESISTOR; DeviceName: 0402-RES; LibraryName: sfe; DeviceSetName: RESISTOR
R4 = RESISTOR0402-RES: ResistorBasic schematic elements and footprints for 0603, 1206, and PTH resistors.; MPN: RC0402JR-0751KL; GateName_1: G$1; SymbolName_1: RESISTOR; DeviceName: 0402-RES; LibraryName: sfe; DeviceSetName: RESISTOR
R5 R9 = R-US_R0603: RESISTOR, American symbol; MPN: CR0603-FX-4700ELF; GateName_1: G$1; SymbolName_1: R-US; DeviceSetName: R-US_; POPULARITY: 77; DeviceName: R0603; LibraryName: rcl; SPICEPREFIX: R
R10 = RESISTOR0402-RES: ResistorBasic schematic elements and footprints for 0603, 1206, and PTH resistors.; MPN: AC0402FR-1310KL; GateName_1: G$1; SymbolName_1: RESISTOR; DeviceName: 0402-RES; LibraryName: sfe; DeviceSetName: RESISTOR
R11 = R-US_R0603: RESISTOR, American symbol; MPN: RK73B1JTTD241J; GateName_1: G$1; SymbolName_1: R-US; DeviceSetName: R-US_; POPULARITY: 77; DeviceName: R0603; LibraryName: rcl; SPICEPREFIX: R
R14 R15 = RESISTOR0402-RES: ResistorBasic schematic elements and footprints for 0603, 1206, and PTH resistors.; MPN: RC0402FR-07169RL; GateName_1: G$1; SymbolName_1: RESISTOR; DeviceName: 0402-RES; LibraryName: sfe; DeviceSetName: RESISTOR
U1 = 74LVC1G17SE-7: DiodesZetex 74LVC1G17SE-7, Buffer, Push-Pull, Non-Inverting, 1.65  5.5 V, 5-Pin SOT-353   Source:  Datasheet; MANUFACTURER_NAME: Diodes Inc.; GateName_1: G$1; SymbolName_1: 74LVC1G17SE-7; LibraryName: 74LVC1G17SE-7; DeviceSetName: 74LVC1G17SE-7; HEIGHT: 1.1mm; MANUFACTURER_PART_NUMBER: 74LVC1G17SE-7; MOUSER_PART_NUMBER: 621-74LVC1G17SE-7; MOUSER_PRICE-STOCK: https://www.mouser.co.uk/ProductDetail/Diodes-Incorporated/74LVC1G17SE-7?qs=FRHfhEBFk1dzIcstjqNcyA%3D%3D; MPN: 74LVC1G17SE-7
Z1 Z3 = MMSZ5231B-7-F: Zener Diode 5.1V 5% 500mW SOD123 Diodes Inc MMSZ5231B-7-F Zener Diode, 5.1V 5% 0.5 W SMT 2-Pin SOD-123   Source:  Datasheet; MANUFACTURER_NAME: Diodes Inc.; GateName_1: G$1; SymbolName_1: MMSZ5231B-7-F; LibraryName: MMSZ5231B-7-F; DeviceSetName: MMSZ5231B-7-F; HEIGHT: 1.45mm; MANUFACTURER_PART_NUMBER: MMSZ5231B-7-F; MOUSER_PART_NUMBER: 621-MMSZ5231B-F; MOUSER_PRICE-STOCK: https://www.mouser.co.uk/ProductDetail/Diodes-Incorporated/MMSZ5231B-7-F?qs=2ygBApjwyeMh7Sf0YL1qSw%3D%3D; MPN: MMSZ5231B-7-F